# EasyEDA Pro project RM_超级电容控制板.eprj, schematic Sheet

## Sheets
1 Sheet_1
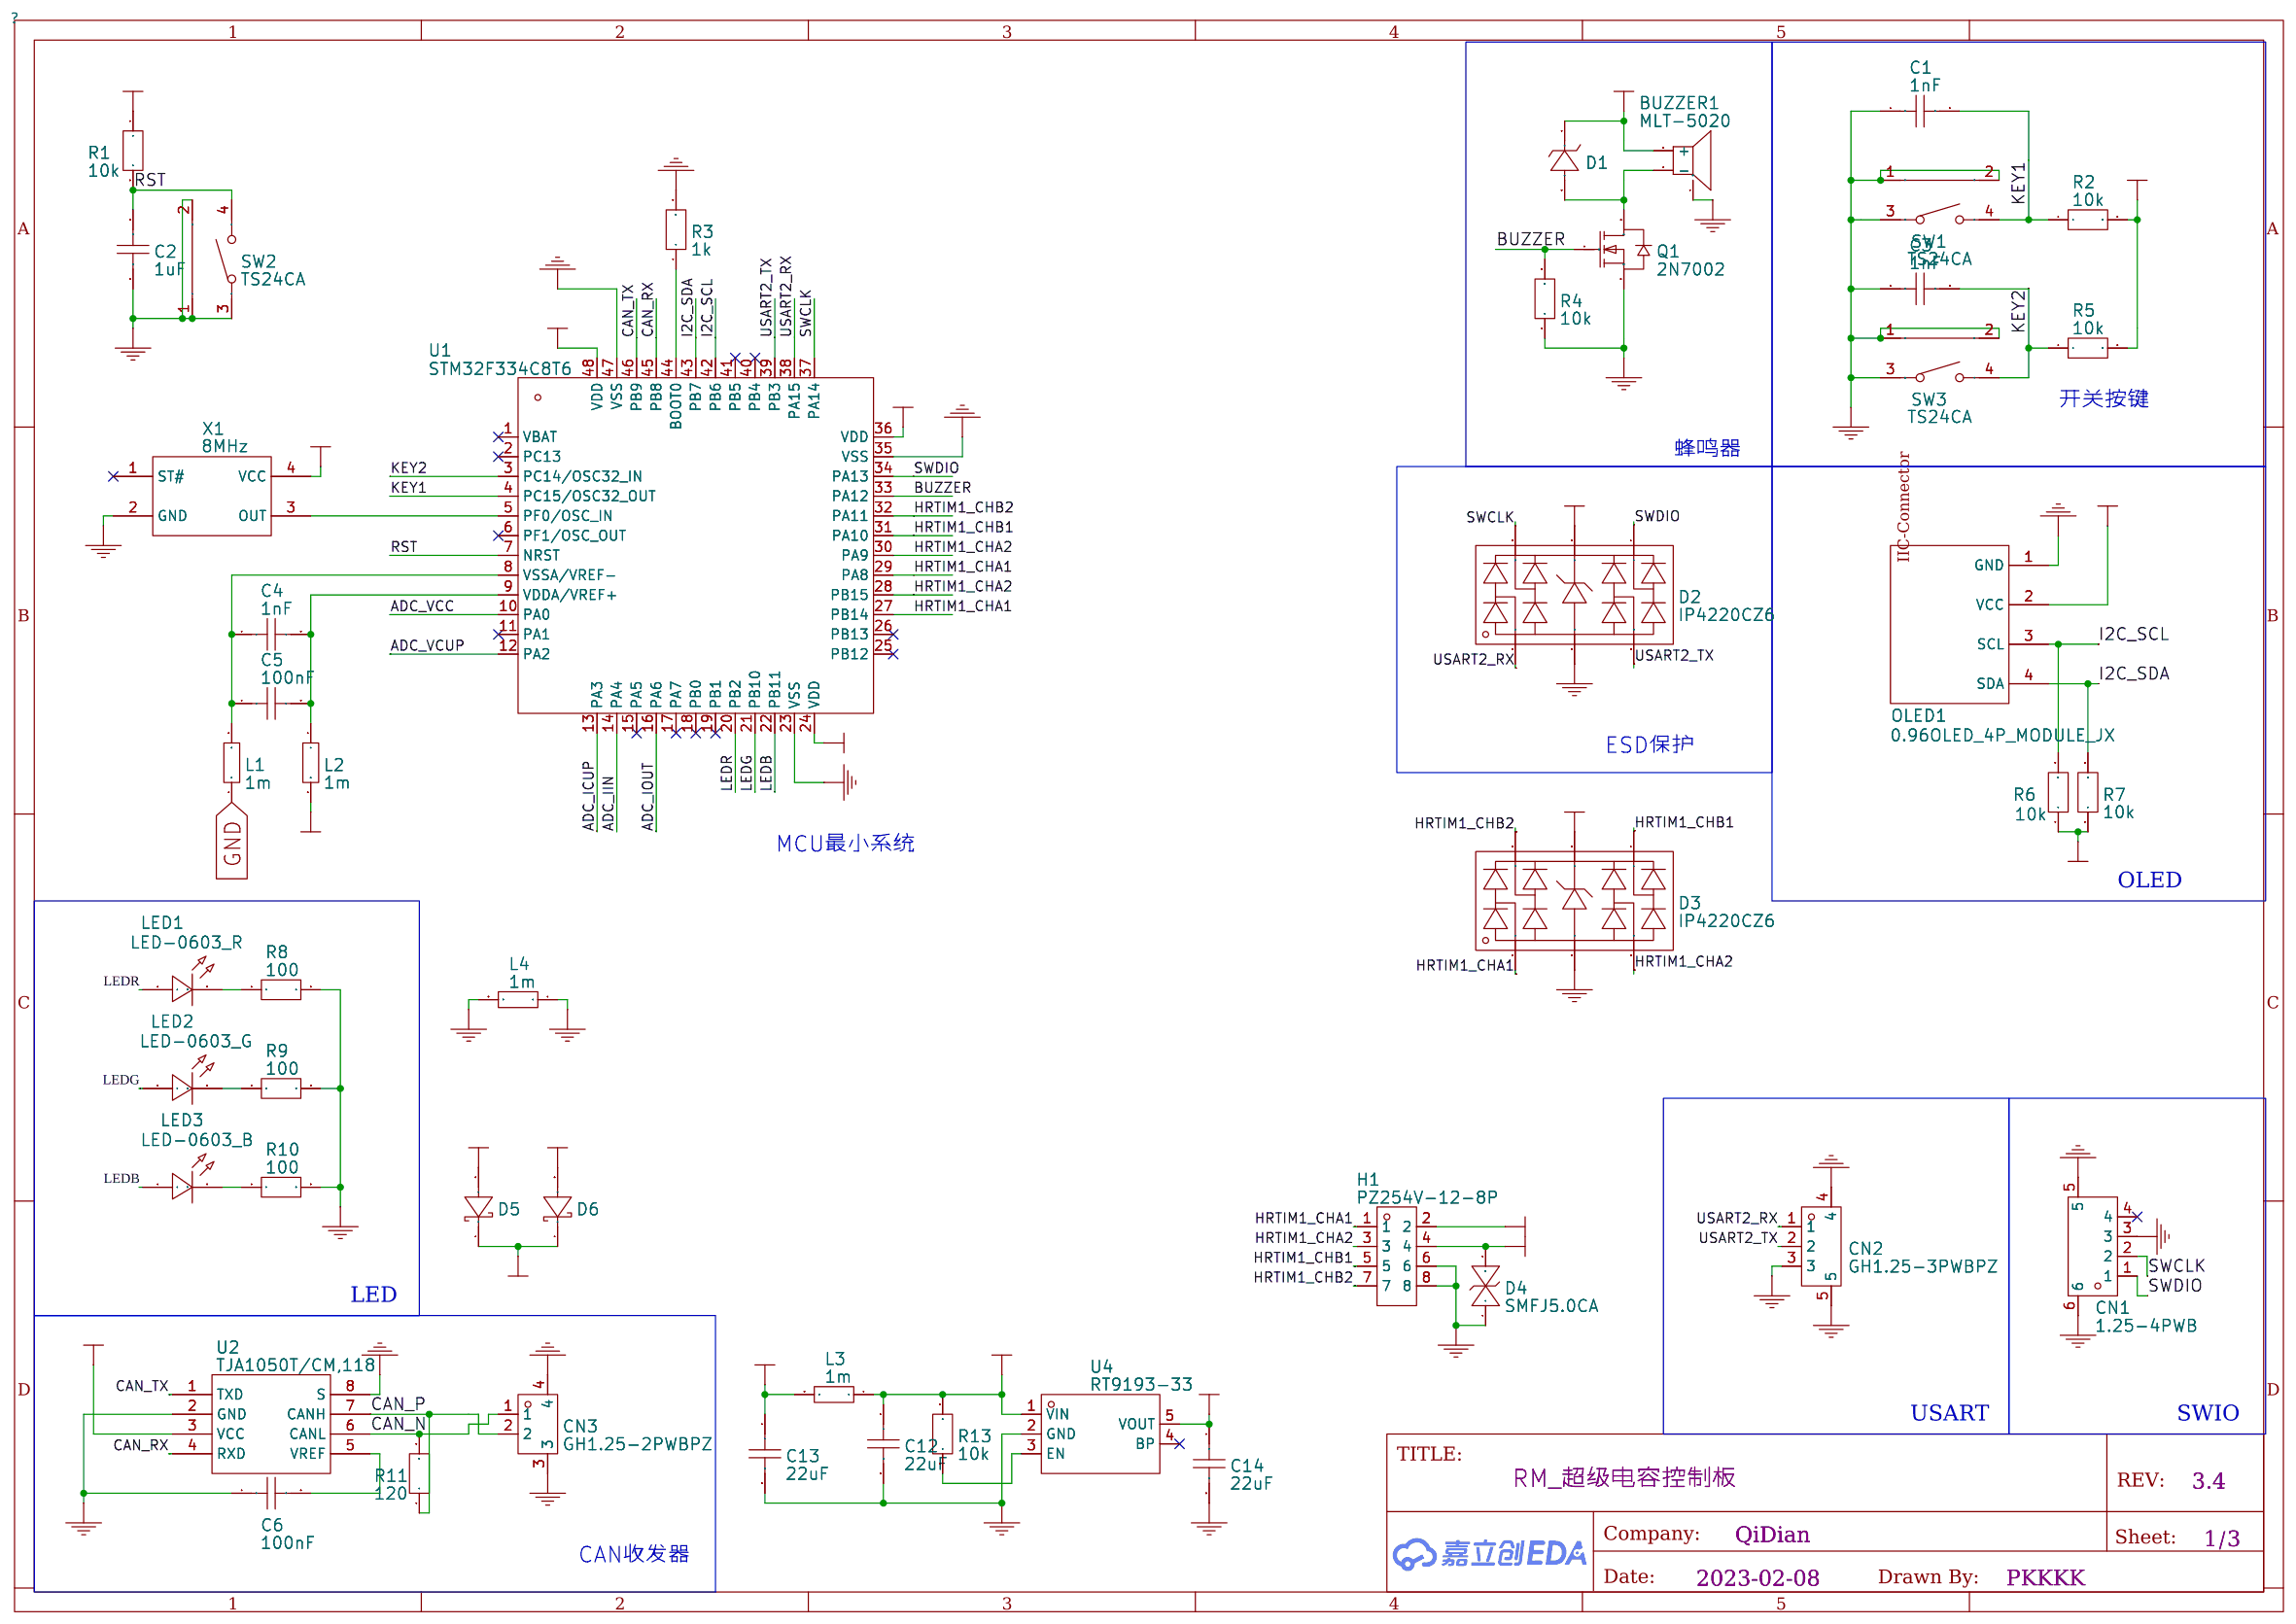
[diagram p0: Sheet_1]
2 Sheet_3
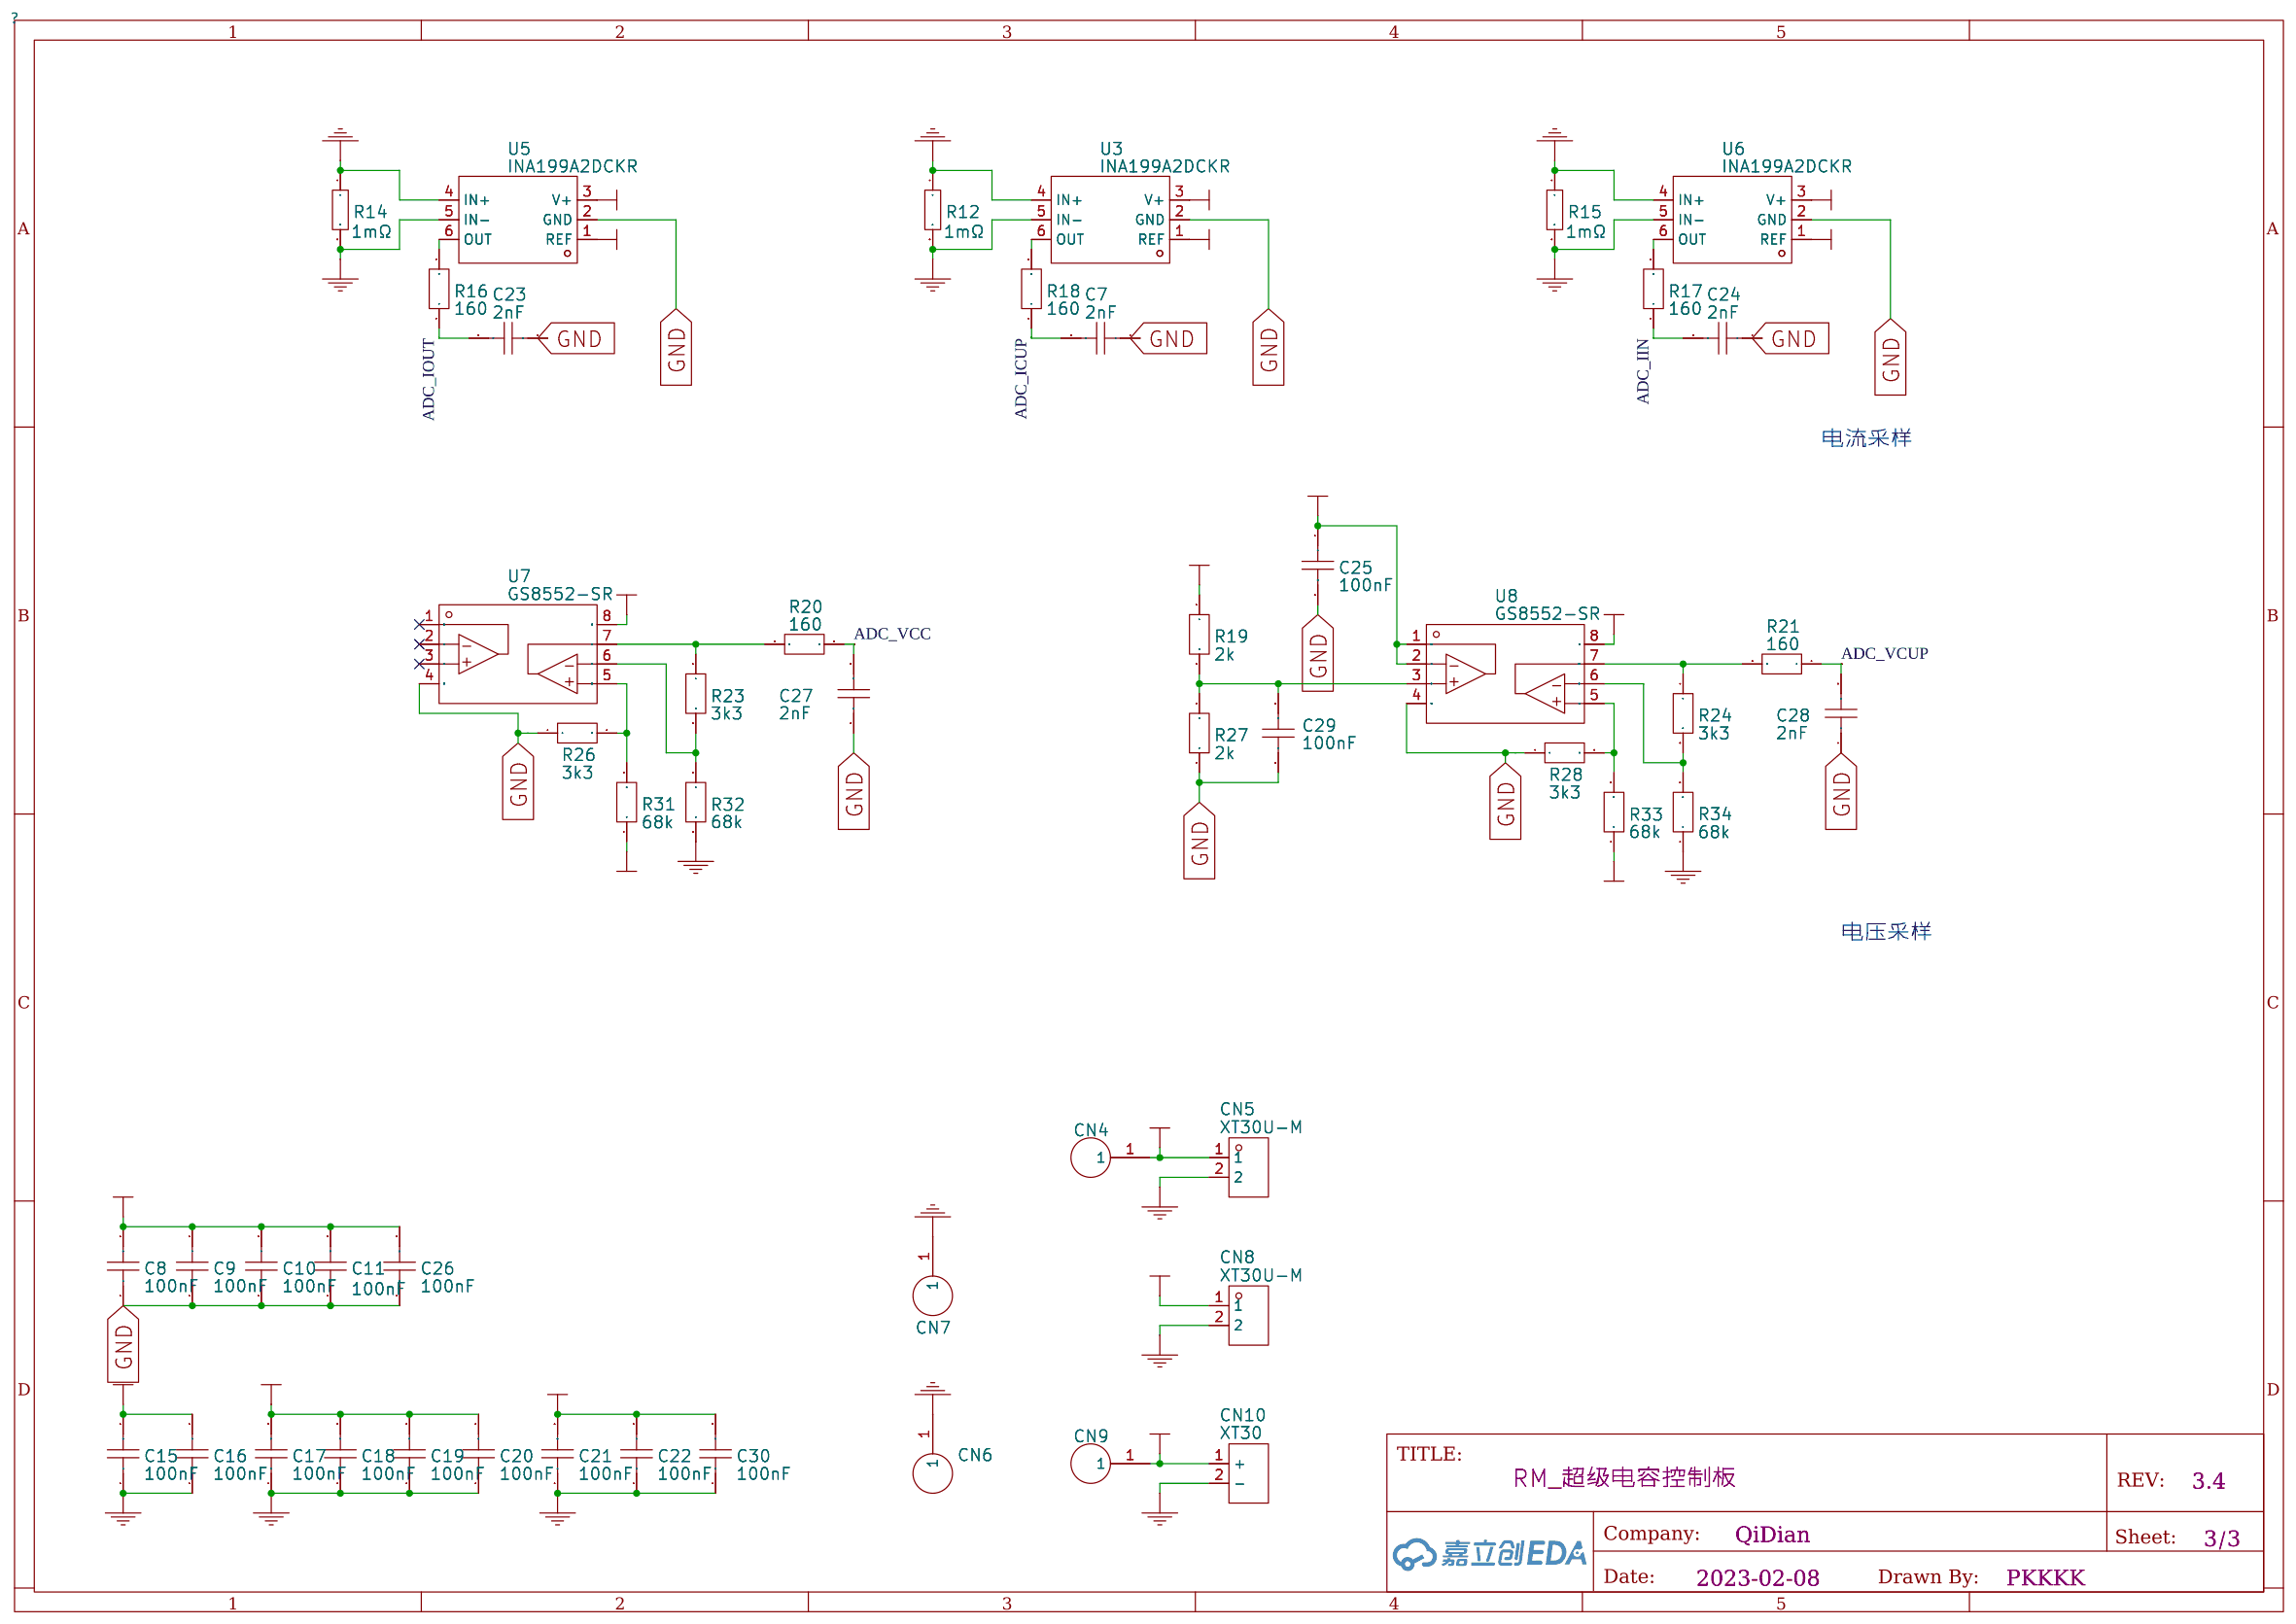
[diagram p1: Sheet_3]

## Parts
sheet Sheet_1
BUZZER1  MLT-5020  [BUZ-SMD_3P-L5.2-W5.2-P3.50-BR]
C1  1nF  [C0603]
C2  1uF  [C0603]
C3  1nF  [C0603]
C4  1nF  [C0603]
C5  100nF  [C0603]
C6  100nF  [C0603]
C12  22uF  [C0805]
C13  22uF  [C0805]
C14  22uF  [C0805]
CN1  1.25-4PWB  [CONN-SMD_1.25-4PWB]
CN2  GH1.25-3PWBPZ  [CONN-SMD_GH1.25-3PWBPZ]
CN3  GH1.25-2PWBPZ  [CONN-SMD_GH1.25-2PWBPZ]
D1  贴片二极管/JSPI3100A/SOD-123FL[捷捷微]  [SOD-123F_L2.7-W1.6-LS3.8-RD]
D2  IP4220CZ6  [SOT-23-6_L2.9-W1.6-P0.95-LS2.7-BL]
D3  IP4220CZ6  [SOT-23-6_L2.9-W1.6-P0.95-LS2.7-BL]
D4  SMFJ5.0CA  [SOD-123_L2.8-W1.8-LS3.7-BI]
D5  DSK310_C713648  [SOD-123_L2.7-W1.8-LS3.7-RD]
D6  DSK310_C713648  [SOD-123_L2.7-W1.8-LS3.7-RD]
H1  PZ254V-12-8P  [HDR-TH_8P-P2.54-V-M-R2-C4-S2.54]
L1  1m  [L0603]
L2  1m  [L0603]
L3  1m  [L0603]
L4  1m  [L0603]
LED1  LED-0603_R  [LED0603_RED]
LED2  LED-0603_G  [LED0603_RED]
LED3  LED-0603_B  [LED0603_RED]
OLED1  0.96OLED_4P_MODULE_JX  [排针2.54单排4PIN]
Q1  2N7002  [SOT-23_L2.9-W1.3-P0.95-LS2.4-BR]
R1  10k  [R0603]
R2  10k  [R0603]
R3  1k  [R0603]
R4  10k  [R0603]
R5  10k  [R0603]
R6  10k  [R0603]
R7  10k  [R0603]
R8  100  [R0603]
R9  100  [R0603]
R10  100  [R0603]
R11  120  [R0603]
R13  10k  [R0603]
SW1  TS24CA  [SW-SMD_TS24CA]
SW2  TS24CA  [SW-SMD_TS24CA]
SW3  TS24CA  [SW-SMD_TS24CA]
U1  STM32F334C8T6  [LQFP-48_L7.0-W7.0-P0.50-LS9.0-BL]
U2  TJA1050T/CM,118  [SOIC-8_L5.0-W4.0-P1.27-LS6.0-BL]
U4  RT9193-33  [SOT-23-5_L2.9-W1.6-P0.95-LS2.8-BL]
X1  8MHz  [OSC-SMD_4P-L3.2-W2.5-BL]
sheet Sheet_3
C7  2nF  [C0603]
C8  100nF  [C0603]
C9  100nF  [C0603]
C10  100nF  [C0603]
C11  100nF  [C0603]
C15  100nF  [C0603]
C16  100nF  [C0603]
C17  100nF  [C0603]
C18  100nF  [C0603]
C19  100nF  [C0603]
C20  100nF  [C0603]
C21  100nF  [C0603]
C22  100nF  [C0603]
C23  2nF  [C0603]
C24  2nF  [C0603]
C25  100nF  [C0603]
C26  100nF  [C0603]
C27  2nF  [C0603]
C28  2nF  [C0603]
C29  100nF  [C0603]
C30  100nF  [C0603]
CN4  m3焊盘  [M3焊盘]
CN5  XT30U-M  [CONN-TH_XT30U-M]
CN6  m3焊盘  [M3焊盘]
CN7  m3焊盘  [M3焊盘]
CN8  XT30U-M  [CONN-TH_XT30U-M]
CN9  m3焊盘  [M3焊盘]
CN10  XT30  [CONN-TH_XT30UPB-F]
R12  1mΩ  [R2512]
R14  1mΩ  [R2512]
R15  1mΩ  [R2512]
R16  160  [R0603]
R17  160  [R0603]
R18  160  [R0603]
R19  2k  [R0603]
R20  160  [R0603]
R21  160  [R0603]
R23  3k3  [R0603]
R24  3k3  [R0603]
R26  3k3  [R0603]
R27  2k  [R0603]
R28  3k3  [R0603]
R31  68k  [R0603]
R32  68k  [R0603]
R33  68k  [R0603]
R34  68k  [R0603]
U3  INA199A2DCKR  [SOT-363_L2.0-W1.3-P0.65-LS2.1-BR]
U5  INA199A2DCKR  [SOT-363_L2.0-W1.3-P0.65-LS2.1-BR]
U6  INA199A2DCKR  [SOT-363_L2.0-W1.3-P0.65-LS2.1-BR]
U7  GS8552-SR  [SOIC-8_L5.0-W4.0-P1.27-LS6.0-BL]
U8  GS8552-SR  [SOIC-8_L5.0-W4.0-P1.27-LS6.0-BL]

## Library data of the parts
BUZZER1 = MLT-5020: link: https://item.szlcsc.com/96499.html; 3DModel: BUZ-SMD_3P-L5.2-W5.2-H2.0-P3.50; Supplier: LCSC; Manufacturer: 华能; Supplier Part: C94598; JLCPCB Part Class: Extended Part; Frequency: 4000Hz
C1 C3 C4 = CL10B102KB8NNNC: 容值:1nF;精度:±10%;额定电压:50V;材质(温度系数):X7R;; LCSC Part Name: 1nF ±10% 50V; Supplier Part: C1588; Manufacturer: SAMSUNG(三星); Supplier Footprint: 0603; JLCPCB Part Class: Basic Part; Datasheet: https://atta.szlcsc.com/upload/public/pdf/source/20160103/1457707679526.pdf; Supplier: LCSC; Tolerance: ±10%; Voltage Rated: 50V; Temperature Coefficient: X7R; link: https://item.szlcsc.com/362304.html; 3DModel: C0603_L1.6-W0.8-H0.8
C2 = CL10A105KB8NNNC: 容值:1uF;精度:±10%;额定电压:50V;材质(温度系数):X5R;; LCSC Part Name: 1uF ±10% 50V; Supplier Part: C15849; Manufacturer: SAMSUNG(三星); Supplier Footprint: 0603; JLCPCB Part Class: Basic Part; Datasheet: https://atta.szlcsc.com/upload/public/pdf/source/20160103/1457707679084.pdf; Supplier: LCSC; Tolerance: ±10%; Voltage Rated: 50V; Temperature Coefficient: X5R; link: https://item.szlcsc.com/362304.html; 3DModel: C0603_L1.6-W0.8-H0.8
C5 = CC0603KRX7R9BB104: 容值:100nF;精度:±10%;额定电压:50V;材质(温度系数):X7R;; LCSC Part Name: 100nF ±10% 50V; Supplier Part: C14663; Manufacturer: YAGEO(国巨); Supplier Footprint: 0603; JLCPCB Part Class: Basic Part; Datasheet: https://atta.szlcsc.com/upload/public/pdf/source/20180910/C282072_33301C7F631E79921B82A8DAC6BCC5B3.pdf; Supplier: LCSC; Tolerance: ±10%; Voltage Rated: 50V; Temperature Coefficient: X7R; link: https://item.szlcsc.com/362304.html; 3DModel: C0603_L1.6-W0.8-H0.8
C6 = 0.1uf: link: https://item.szlcsc.com/362304.html; 3DModel: C0603_L1.6-W0.8-H0.8
C12-C14 = 22u: link: https://item.szlcsc.com/373011.html; 3DModel: C0805_L2.0-W1.3-H1.3
CN1 = 1.25-4PWB: link: https://atta.szlcsc.com/upload/public/pdf/source/20211025/32B11FCE5054D08D2841E43E3DE676AA.pdf; Supplier: LCSC; Supplier Part: C2905011; Manufacturer: DEALON(德艺隆); JLCPCB Part Class: Extended Part
CN2 = GH1.25-3PWBPZ: link: https://so.szlcsc.com/global.html?c=&k=C2829252; Supplier: LCSC; Supplier Part: C2829252; Manufacturer: BOOMELE(博穆精密); JLCPCB Part Class: Extended Part
CN3 = GH1.25-2PWBPZ: link: https://atta.szlcsc.com/upload/public/pdf/source/20211125/08A09A4909F58AF780B71FE423A00F7E.pdf; Supplier: LCSC; Supplier Part: C2829251; Manufacturer: BOOMELE(博穆精密); JLCPCB Part Class: Extended Part
D1 = 贴片二极管/JSPI3100A/SOD-123FL[捷捷微]: link: http://www.jinghenggroup.com/DATABOOK2010/10ZENER/MM1Z2V0THRUMM1Z120SOD123.pdf; Supplier: LCSC; Supplier Part: C9900018891; Manufacturer: null; JLCPCB Part Class: Extended Part
D2 D3 = IP4220CZ6: link: https://www.alliedelec.com/m/d/8fb12d70811811a8478fbc57f83b0171.pdf; Supplier: LCSC; Supplier Part: C2687127; Manufacturer: UMW(友台半导体); JLCPCB Part Class: Extended Part
D4 = SMFJ5.0CA: link: https://item.szlcsc.com/301420.html; 3DModel: SOD-123_L2.8-W1.8-H1.4-LS3.7; Supplier: LCSC; Supplier Part: C511919; Manufacturer: BORN(伯恩半导体); Manufacturer Part: SMFJ3.3CA; JLCPCB Part Class: Extended Part
D5 D6 = DSK310_C713648: link: https://atta.szlcsc.com/upload/public/pdf/source/20191009/C435458_48A497743F79394405122F4857DC52B9.pdf; Supplier: LCSC; Supplier Part: C713648; Manufacturer: LGE(鲁光); Manufacturer Part: DSK310; JLCPCB Part Class: Extended Part
H1 = PZ254V-12-8P: link: https://item.szlcsc.com/502977.html; 3DModel: HDR-TH_8P-P2.54-M-LI-2X4P; Supplier: LCSC; Supplier Part: C492421; Manufacturer: XFCN(兴飞); JLCPCB Part Class: Extended Part
L1-L4 = 1m: link: https://item.szlcsc.com/344093.html; 3DModel: L0603_L1.6-W0.8-H0.5_BEAD
LED1 = LED-0603_R: 3DModel: LED0603_Red; Manufacturer: EVERLIGHT(台湾亿光); Manufacturer Part: 19-217/R6C-AL1M2VY/3T; Supplier Part: C72044; Supplier: LCSC
LED2 = LED-0603_G: 3DModel: LED0603_Red; Manufacturer: EVERLIGHT(台湾亿光); Manufacturer Part: 19-217/R6C-AL1M2VY/3T; Supplier Part: C72044; Supplier: LCSC
LED3 = LED-0603_B: 3DModel: LED0603_Red; Manufacturer: EVERLIGHT(台湾亿光); Manufacturer Part: 19-217/R6C-AL1M2VY/3T; Supplier Part: C72044; Supplier: LCSC
OLED1 = 0.96OLED_4P_MODULE_JX: Supplier: LCSC; Supplier Part: C9900004566; Manufacturer: null; JLCPCB Part Class: Extended Part; 3DModel: OLED4P
Q1 = 2N7002: link: https://item.szlcsc.com/236142.html; 3DModel: SOT-23-3P_L2.9-W1.3-H1.0-LS2.4-P0.95; Supplier: LCSC; Manufacturer: Nexperia; Manufacturer Part: 2N7002,215; image: //image.lceda.cn/szlcsc/C65189.jpg; Supplier Part: C65189; Paste Type: expand
R1 R2 R4-R7 R13 = 10k: link: https://www.mouser.in/datasheet/2/447/PYu_RT_1_to_0_01_RoHS_L_11-1669912.pdf
R3 = 1k: link: https://www.mouser.in/datasheet/2/447/PYu_RT_1_to_0_01_RoHS_L_11-1669912.pdf
R8-R10 R16-R18 R20 R21 = 100: link: https://www.mouser.in/datasheet/2/447/PYu_RT_1_to_0_01_RoHS_L_11-1669912.pdf
R11 = 120: link: https://www.mouser.in/datasheet/2/447/PYu_RT_1_to_0_01_RoHS_L_11-1669912.pdf
SW1-SW3 = TS24CA: link: https://item.szlcsc.com/372554.html; Supplier: LCSC; Supplier Part: C393942; Manufacturer: SHOU HAN(首韩); JLCPCB Part Class: Extended Part
U1 = STM32F334C8T6: link: https://atta.szlcsc.com/upload/public/pdf/source/20190808/C411336_D1D2DF7683029D856BA010BA7A5BF7EA.pdf; Supplier Part: C99450; Supplier: LCSC; 3DModel: LQFP-48_L7.0-W7.0-H1.4-LS9.0-P0.50; Manufacturer: STMicroelectronics; JLCPCB Part Class: Extended Part
U2 = TJA1050T/CM,118: link: https://item.szlcsc.com/417287.html; 3DModel: SOIC-8_L4.9-W3.9-H1.7-LS6.0-P1.27; Supplier: LCSC; Manufacturer: NXP(恩智浦); Supplier Part: C6952; JLCPCB Part Class: Basic Part
U4 = RT9193-33: link: https://cn.bing.com/search?q=datasheetAD8067ARTZ-REEL7; Supplier: LCSC; Supplier Part: C9900015455; Manufacturer: null; JLCPCB Part Class: Extended Part
X1 = 8MHz: link: https://item.szlcsc.com/15866.html; 3DModel: OSC-SMD_4P-L3.2-W2.5-H1.0; Supplier: LCSC; Manufacturer: EPSON; Manufacturer Part: Q33310F70055100; Supplier Part: C70556; JLCPCB Part Class: Extended Part
C7 C23-C25 C27-C29 = 330pF: link: https://item.szlcsc.com/362304.html; 3DModel: C0603_L1.6-W0.8-H0.8
C8-C11 C15-C22 C26 C30 = 0.1u: link: https://item.szlcsc.com/362304.html; 3DModel: C0603_L1.6-W0.8-H0.8
CN4 CN6 CN7 CN9 = m3焊盘
CN5 CN8 = XT30U-M: link: https://atta.szlcsc.com/upload/public/pdf/source/20170606/1496716542582.pdf; Supplier: LCSC; Supplier Part: C99101; Manufacturer: AMASS(艾迈斯); JLCPCB Part Class: Extended Part
CN10 = XT30: link: https://item.szlcsc.com/109989.html; Supplier: LCSC; Supplier Part: C108769; Manufacturer: Changzhou Amass Elec; Manufacturer Part: XT30UPB-F; JLCPCB Part Class: Extended Part
R12 R14 R15 = 2mΩ: link: https://item.szlcsc.com/347967.html; 3DModel: R2512_L6.3-W3.2-H0.6; Supplier: LCSC; Supplier Part: C252684; Manufacturer: Ever Ohms Tech; Manufacturer Part: MA251230FR005MZ; Resistance: 0.005; JLCPCB Part Class: Extended Part
R19 R27 = 2k: link: https://www.mouser.in/datasheet/2/447/PYu_RT_1_to_0_01_RoHS_L_11-1669912.pdf
R23 R24 R26 R28 = 3k3: link: https://www.mouser.in/datasheet/2/447/PYu_RT_1_to_0_01_RoHS_L_11-1669912.pdf
R31-R34 = 68k: link: https://www.mouser.in/datasheet/2/447/PYu_RT_1_to_0_01_RoHS_L_11-1669912.pdf
U3 U5 U6 = INA199A2DCKR: link: https://item.szlcsc.com/97429.html; 3DModel: SOT-363-6P_L2.0-W1.3-H1.1-LS2.0-P0.65; Supplier: LCSC; Manufacturer: TI(德州仪器); Supplier Part: C131913; JLCPCB Part Class: Extended Part
U7 U8 = GS8552-SR: link: https://item.szlcsc.com/417287.html; 3DModel: SOIC-8_L4.9-W3.9-H1.7-LS6.0-P1.27; Supplier: LCSC; Supplier Part: C157716; Manufacturer: Gainsil; JLCPCB Part Class: Extended Part

## Nets
1.65V: C21.2 C22.2 C25.1 C30.2 U3.1(REF) U5.1(REF) U6.1(REF) U8.1(OUTA) U8.2(INA-)
3V3: C14.1 C17.2 C18.2 C19.2 C20.2 L2.2 R1.1 R2.2 R5.2 R6.1 R7.1 R19.1 U1.24(VDD) U1.36(VDD) U1.48(VDD) U4.5(VOUT) X1.4(VCC)
+5V: BUZZER1.2(+) C12.1 C15.2 C16.2 D1.1(K) D2.5 D3.5 D4.2 H1.4 L3.1 OLED1.2(VCC) R13.2 U2.3(VCC) U4.1(VIN)
AVCC: C8.2 C9.2 C10.2 C11.2 C13.1 C26.2 L3.2 U3.3(V+) U5.3(V+) U6.3(V+) U7.8(VDD) U8.8(VDD)
GND: BUZZER1.1(NC) C1.1 C2.1 C3.1 C6.1 C7.1 C8.1 C9.1 C10.1 C11.1 C12.2 C13.2 C14.2 C15.1 C16.1 C17.1 C18.1 C19.1 C20.1 C21.1 C22.1 C23.1 C24.1 C25.2 C26.1 C27.1 C28.1 C29.1 C30.1 CN1.3 CN1.5 CN1.6 CN2.3 CN2.4 CN2.5 CN3.3 CN3.4 D2.2 D3.2 D4.1 H1.6 H1.8 L1.1 L4.2 OLED1.1(GND) Q1.2(S) R3.2 R4.1 R8.2 R9.2 R10.2 R26.1 R27.2 R28.1 SW1.1 SW1.2 SW1.3 SW2.1 SW2.2 SW2.3 SW3.1 SW3.2 SW3.3 U1.23(VSS) U1.35(VSS) U1.47(VSS) U2.2(GND) U2.8(S) U3.2(GND) U4.2(GND) U5.2(GND) U6.2(GND) U7.4(VSS) U8.4(VSS) X1.2(GND)
PGND: CN7.1 L4.1 R14.1 R15.1 R32.2 R34.1 U5.4(IN+) U6.4(IN+)
PGND_CUP: CN6.1 R12.1 U3.4(IN+)
PGND_CUP_IN: CN5.2 R12.2 U3.5(IN-)
PGND_IN: CN8.2 R15.2 U6.5(IN-)
PGND_OUT: CN10.2(-) R14.2 U5.5(IN-)
VCC: CN8.1 CN9.1 CN10.1(+) D6.2(A) R31.1
VCC1: D5.1(K) D6.1(K) H1.2
ADC_ICUP: C7.2 R18.1 U1.13(PA3)
ADC_IIN: C24.2 R17.1 U1.14(PA4)
ADC_IOUT: C23.2 R16.1 U1.16(PA6)
ADC_VCC: C27.2 R20.1 U1.10(PA0)
ADC_VCUP: C28.2 R21.1 U1.12(PA2)
BUZZER: Q1.1(G) R4.2 U1.33(PA12)
CAN_N: CN3.1 R11.2 U2.6(CANL)
CAN_P: CN3.2 R11.1 U2.7(CANH)
CAN_RX: U1.45(PB8) U2.4(RXD)
CAN_TX: U1.46(PB9) U2.1(TXD)
HRTIM1_CHA1: D3.1 H1.1 U1.27(PB14) U1.29(PA8)
HRTIM1_CHA2: D3.3 H1.3 U1.28(PB15) U1.30(PA9)
HRTIM1_CHB1: D3.4 H1.5 U1.31(PA10)
HRTIM1_CHB2: D3.6 H1.7 U1.32(PA11)
I2C_SCL: OLED1.3(SCL) R6.2 U1.42(PB6)
I2C_SDA: OLED1.4(SDA) R7.2 U1.43(PB7)
KEY1: C1.2 R2.1 SW1.4 U1.4(PC15/OSC32_OUT)
KEY2: C3.2 R5.1 SW3.4 U1.3(PC14/OSC32_IN)
LEDB: LED3.1 U1.22(PB11)
LEDG: LED2.1 U1.21(PB10)
LEDR: LED1.1 U1.20(PB2)
RST: C2.2 R1.2 SW2.4 U1.7(NRST)
SWCLK: CN1.2 D2.6 U1.37(PA14)
SWDIO: CN1.1 D2.4 U1.34(PA13)
USART2_RX: CN2.1 D2.1 U1.38(PA15)
USART2_TX: CN2.2 D2.3 U1.39(PB3)
VCUP: CN4.1 CN5.1 D5.2(A) R33.1
BUZZER1_3: BUZZER1.3(-) D1.2(A) Q1.3(D)
C4_1: C4.1 C5.1 L1.2 U1.8(VSSA/VREF-)
C6_2: C6.2 U2.5(VREF)
C29_2: C29.2 R19.2 R27.1 U8.3(INA+)
L2_1: C4.2 C5.2 L2.1 U1.9(VDDA/VREF+)
R3_1: R3.1 U1.44(BOOT0)
R8_1: LED1.2 R8.1
R9_1: LED2.2 R9.1
R10_1: LED3.2 R10.1
R13_1: R13.1 U4.3(EN)
R16_2: R16.2 U5.6(OUT)
R20_2: R20.2 R23.1 U7.7(OUTB)
R23_2: R23.2 R32.1 U7.6(INB-)
R24_1: R21.2 R24.1 U8.7(OUTB)
R24_2: R24.2 R34.2 U8.6(INB-)
R26_2: R26.2 R31.2 U7.5(INB+)
U3_6: R18.2 U3.6(OUT)
U6_6: R17.2 U6.6(OUT)
U8_5: R28.2 R33.2 U8.5(INB+)
X1_3: U1.5(PF0/OSC_IN) X1.3(OUT)

Not connected (* = marked no-connect by the designer): CN1 4*; U1 1(VBAT)* 2(PC13)* 6(PF1/OSC_OUT)* 11(PA1)* 15(PA5)* 17(PA7)* 18(PB0)* 19(PB1)* 25(PB12)* 26(PB13)* 40(PB4)* 41(PB5)*; U4 4(BP)*; U7 1(OUTA)* 2(INA-)* 3(INA+)*; X1 1(ST#)*

## Notes on the sheets
sheet 1
- 开关按键
- 蜂鸣器
- ESD保护
- MCU最小系统
- OLED
- LED
- USART
- SWIO
- CAN收发器
sheet 2
- 电流采样
- 电压采样
